# EAGLE design main_R1 (EAGLE 7.1.0)
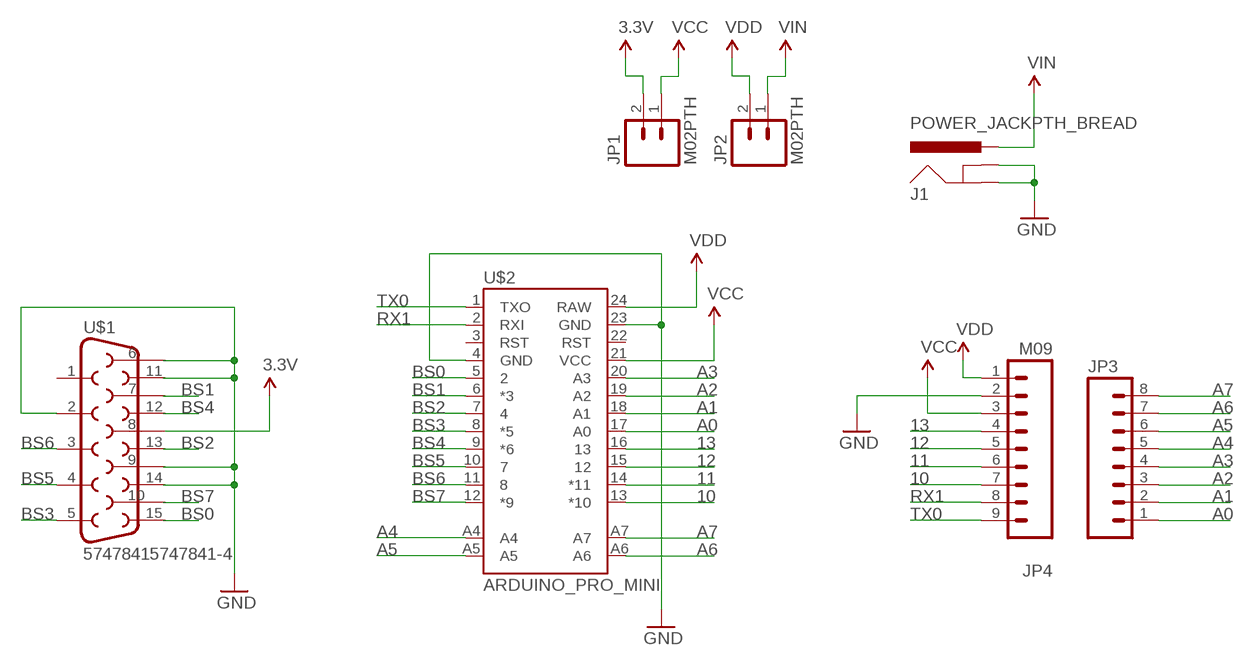
[diagram p0: schematic, sheet 1]

## Parts
J1  POWER_JACKPTH_BREAD  [POWER_JACK_PTH_BREAD]
JP1  M02PTH  [1X02]
JP2  M02PTH  [1X02]
JP3  M081X08  [1X08]
JP4  M09  [1X09]
U$1  57478415747841-4  [5747841]
U$2  ARDUINO_PRO_MINI  [ARDUINO_PRO_MINI]

## Nets
3.3V: JP1.2 U$1.8
10: JP4.7 U$2.13(*10)
11: JP4.6 U$2.14(*11)
12: JP4.5 U$2.15
13: JP4.4 U$2.16
A0: JP3.1 U$2.17(A0)
A1: JP3.2 U$2.18(A1)
A2: JP3.3 U$2.19(A2)
A3: JP3.4 U$2.20(A3)
A4: JP3.5 U$2.A4
A5: JP3.6 U$2.A5
A6: JP3.7 U$2.A6
A7: JP3.8 U$2.A7
BS0: U$1.15 U$2.5
BS1: U$1.7 U$2.6(*3)
BS2: U$1.13 U$2.7
BS3: U$1.5 U$2.8(*5)
BS4: U$1.12 U$2.9(*6)
BS5: U$1.4 U$2.10
BS6: U$1.3 U$2.11
BS7: U$1.10 U$2.12(*9)
GND: J1.GND J1.GNDBREAK JP4.2 U$1.2 U$1.6 U$1.9 U$1.11 U$1.14 U$2.4(GND) U$2.23(GND)
RX1: JP4.8 U$2.2(RXI)
TX0: JP4.9 U$2.1(TXO)
VCC: JP1.1 JP4.3 U$2.21(VCC)
VDD: JP2.2 JP4.1 U$2.24(RAW)
VIN: J1.PWR JP2.1
Unconnected: U$1.1 U$2.3(RST) U$2.22(RST)

## Library data of the parts
J1 = SparkFun-Connectors:POWER_JACK: Power Jack This is the standard 5.5mm barrel jack for power. The PTH is the most common, proven, reliable, footprint. The Slot footprint only works if the mill layer is transmitted to the PCB fab house so be warned. Mating wall wart : TOL-00298 (and others); PROD_ID: PRT-10811
JP1 JP2 = SparkFun-Connectors:M02: Standard 2-pin 0.1" header. Use with - straight break away headers ( PRT-00116) - right angle break away headers (PRT-00553) - swiss pins (PRT-00743) - machine pins (PRT-00117) - female headers (PRT-00115) Molex polarized connector foot print use with: PRT-08233 with associated crimp pins and housings. 2.54_SCREWTERM for use with PRT-10571. 3.5mm Screw Terminal footprints for PRT-08084 5mm Screw Terminal footprints for use with PRT-08433
JP3 = SparkFun-Connectors:M08: Header 8 Standard 8-pin 0.1" header. Use with straight break away headers (SKU : PRT-00116), right angle break away headers (PRT-00553), swiss pins (PRT-00743), machine pins (PRT-00117), and female headers (PRT-00115).
JP4 = SparkFun-Connectors:M09: Header 9 Standard 9-pin 0.1" header. Use with straight break away headers (SKU : PRT-00116), right angle break away headers (PRT-00553), swiss pins (PRT-00743), machine pins (PRT-00117), and female headers (PRT-00115).
U$1 = myLibrary:5747841
U$2 = SparkFun-Boards:ARDUINO_PRO_MINI

## Board
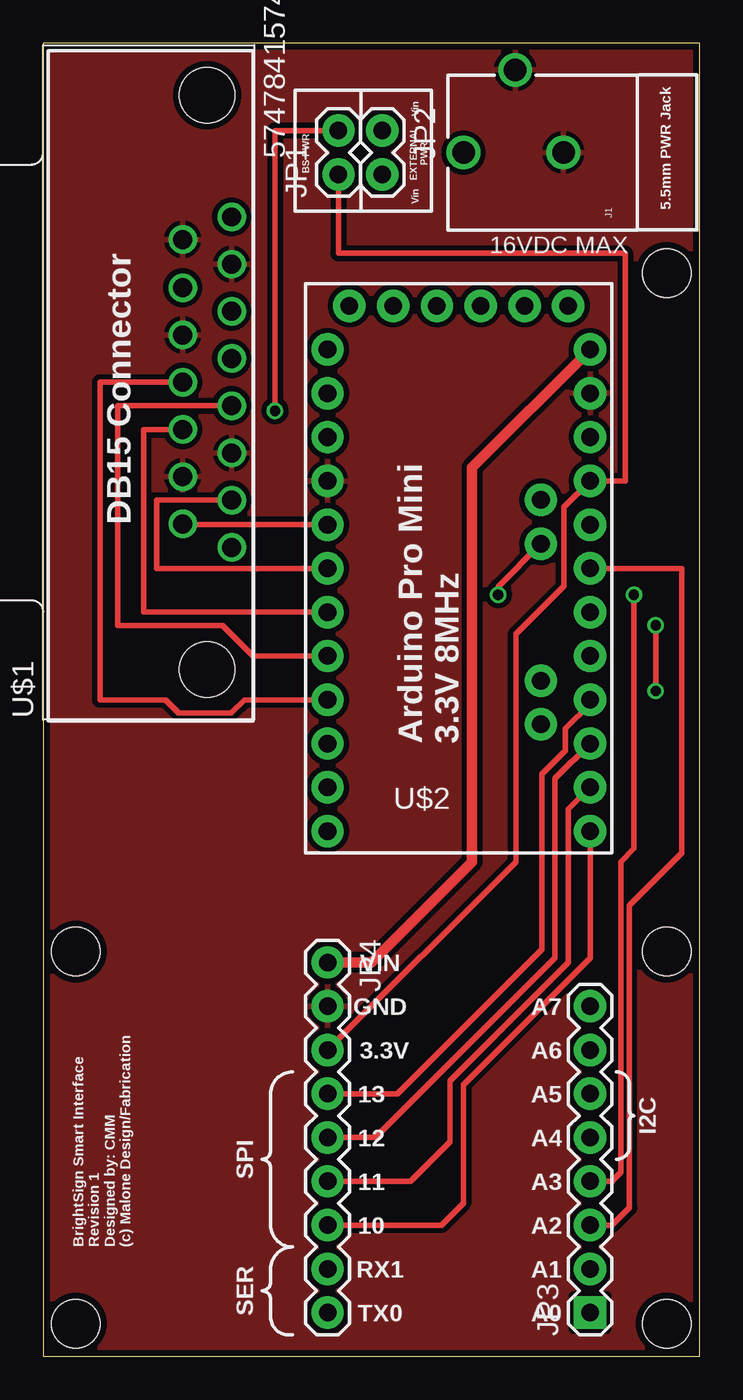
[diagram p1: board, top side]
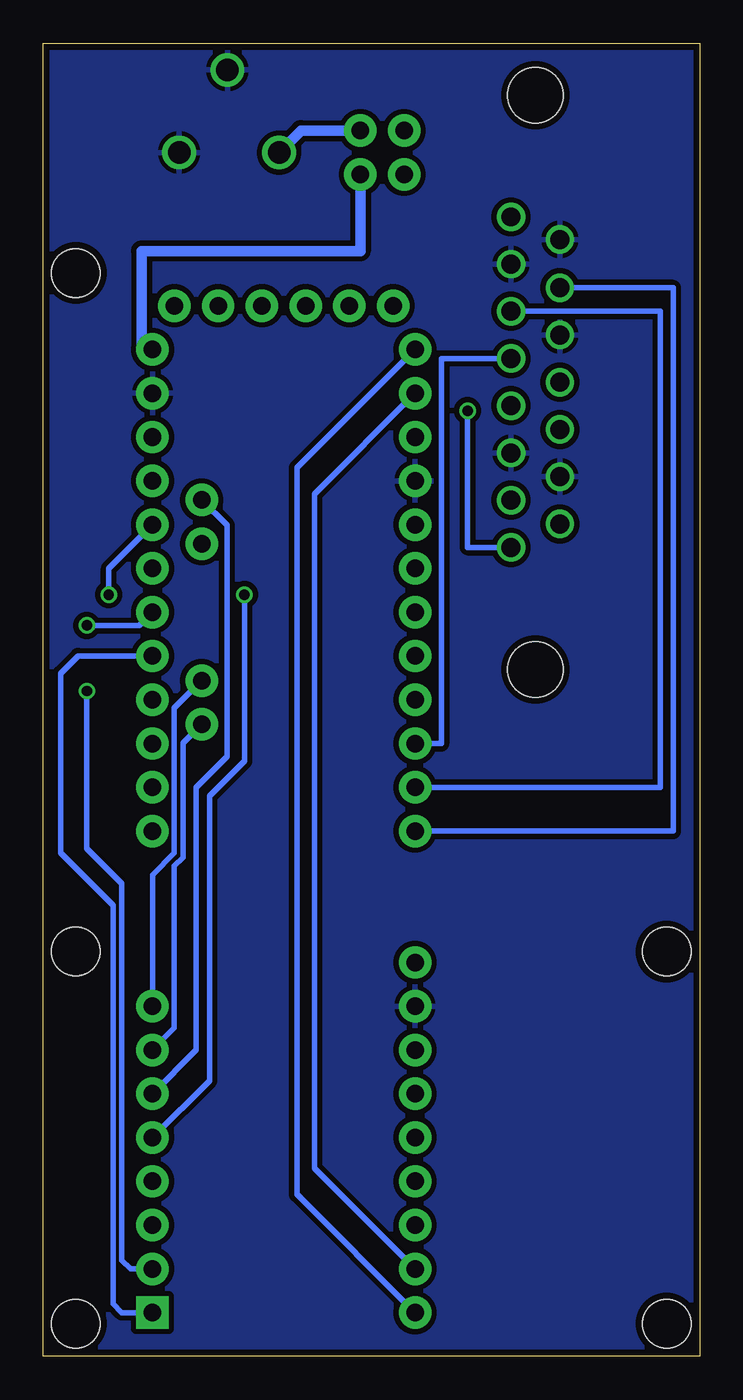
[diagram p2: board, bottom side, seen from below]

Size 38.1 x 76.2 mm. Coordinates in mm from the lower left corner, seen from the top.
Outline: 0,0 38.1,0 38.1,76.2 0,76.2 0,0
Copper layers (1*16): Top 0.0356mm / dielectric 1.5011mm / Bottom 0.0356mm
Design rules "LaenPCBOrder": minimum track width 6mil, minimum drill 13mil, track to track 6mil, track to pad 6mil, pad to pad 6mil, via to via 6mil, smd to smd 6mil, copper to edge 15mil, drill to drill 6mil, minimum pad ring 7mil, minimum via ring 7mil, stop-mask expansion 3mil, vias tented up to drill 0mil, thermal gap 10mil
Holes 2.8 mm at 1.91,1.91 36.2,1.91 36.2,62.87 1.91,23.5 36.2,23.5

### Footprints (pad centres in the part's own frame; a part is rotated, then mirrored left to right if it is on the bottom)
POWER_JACK_PTH_BREAD = drill 1.3: GND 0,7.9; GNDBREAK 4.8,10.7; PWR 0,13.7
1X02 = drill 1.016 pad 1.88: 1 0,0; 2 2.54,0
1X08 = drill 1.016 pad 1.88 square: 1 0,0 | drill 1.016 pad 1.88: 2 2.54,0; 3 5.08,0; 4 7.62,0; 5 10.16,0; 6 12.7,0; 7 15.24,0; 8 17.78,0
1X09 = drill 1.016 pad 1.88: 1 0,0; 2 2.54,0; 3 5.08,0; 4 7.62,0; 5 10.16,0; 6 12.7,0; 7 15.24,0; 8 17.78,0; 9 20.32,0
5747841 = drill 1.1: 1 9.6,-1.42; 2 6.86,-1.42; 3 4.12,-1.42; 4 1.38,-1.42; 5 -1.36,-1.42; 6 -4.1,-1.42; 7 -6.84,-1.42; 8 -9.58,-1.42; 9 8.29,1.42; 10 5.49,1.42; 11 2.75,1.42; 12 0.01,1.42; 13 -2.73,1.42; 14 -5.47,1.42; 15 -8.21,1.42 | hole 3.2: -16.66,0; 16.66,0
ARDUINO_PRO_MINI = drill 1.016 pad 1.88: 1 -7.62,12.7; 2 -7.62,10.16; 3 -7.62,7.62; 4 -7.62,5.08; 5 -7.62,2.54; 6 -7.62,0; 7 -7.62,-2.54; 8 -7.62,-5.08; 9 -7.62,-7.62; 10 -7.62,-10.16; 11 -7.62,-12.7; 12 -7.62,-15.24; 13 7.62,-15.24; 14 7.62,-12.7; 15 7.62,-10.16; 16 7.62,-7.62; 17 7.62,-5.08; 18 7.62,-2.54; 19 7.62,0; 20 7.62,2.54; 21 7.62,5.08; 22 7.62,7.62; 23 7.62,10.16; 24 7.62,12.7; A4 4.763,1.429; A5 4.763,3.969; A6 4.763,-9.049; A7 4.763,-6.509; BLK -6.35,15.24; GND -3.81,15.24; GRN 6.35,15.24; RXI 1.27,15.24; TXO 3.81,15.24; VCC -1.27,15.24

### Placement (x,y rotation side)
J1  38.1,69.85 90 top
JP1  17.14,68.58 90 top
JP2  19.68,71.12 270 top
JP3  31.75,2.54 90 top
JP4  16.51,22.86 270 top
U$1  9.53,56.52 90 top
U$2  24.13,45.72 0 top

### Tracks (layer width: path | path; a pad name or v marks a point on that pad's centre or on a via)
3.3V  (via drill 0.6)
  Top 0.305: JP1.2 13.46,71.12 v13.46,54.86
  Bottom 0.305: v13.46,54.86 13.46,46.94 U$1.8
10
  Top 0.305: U$2.13 31.75,23.11 24.38,15.75 24.38,8.89 23.11,7.62 JP4.7
11
  Top 0.305: U$2.14 30.48,31.75 30.48,22.86 23.62,16 23.62,12.45 21.34,10.16 JP4.6
12
  Top 0.305: U$2.15 29.72,33.53 29.72,23.11 19.3,12.7 JP4.5
13
  Top 0.305: JP4.4 20.57,15.24 28.96,23.62 28.96,33.78 30.33,35.15 30.33,36.42 31.75,37.85 U$2.16
A0
  Bottom 0.305: JP3.1 33.53,2.54 34.04,3.05 34.04,26.16 37.08,29.21 37.08,39.62 36.07,40.64 U$2.17
A1  (via drill 0.6)
  Top 0.305: v35.56,38.61 v35.56,42.42
  Bottom 0.305: JP3.2 33.02,5.08 33.53,5.59 33.53,27.43 35.56,29.46 v35.56,38.61 | v35.56,42.42 32.51,42.42 U$2.18
A2
  Top 0.305: JP3.3 33.02,7.62 34.04,8.64 34.04,26.16 37.08,29.21 37.08,45.72 U$2.19
A3  (via drill 0.6)
  Top 0.305: JP3.4 33.02,10.16 33.53,10.67 33.53,28.7 34.29,29.46 v34.29,44.2
  Bottom 0.305: v34.29,44.2 34.29,45.72 U$2.20
A4  (via drill 0.6)
  Top 0.305: v26.42,44.2 26.42,44.67 U$2.A4
  Bottom 0.305: JP3.5 28.45,16 28.45,32.51 26.42,34.54 v26.42,44.2
A5
  Bottom 0.305: JP3.6 29.21,17.78 29.21,33.02 27.43,34.8 27.43,48.23 U$2.A5
A6
  Bottom 0.305: U$2.A6 29.97,35.59 29.97,28.96 30.48,28.45 30.48,19.05 JP3.7
A7
  Bottom 0.305: JP3.8 31.75,27.94 30.48,29.21 30.48,37.62 U$2.A7
BS0
  Top 0.305: U$2.5 8.11,48.26 U$1.15
BS1
  Top 0.305: U$2.6 6.6,45.72 6.6,49.67 U$1.7
BS2
  Top 0.305: U$2.7 5.84,43.18 5.84,53.78 U$1.13
BS3
  Top 0.305: U$2.8 12.19,40.64 10.41,42.42 4.32,42.42 4.32,55.16 U$1.5
BS4
  Top 0.305: U$2.9 11.68,38.1 10.92,37.34 7.87,37.34 7.11,38.1 3.3,38.1 3.3,56.52 U$1.12
BS5
  Bottom 0.305: U$1.4 14.99,57.9 14.99,35.56 U$2.10
BS6
  Bottom 0.305: U$1.3 10.95,60.66 2.29,60.66 2.29,33.02 U$2.11
BS7
  Bottom 0.305: U$2.12 1.52,30.48 1.52,62.01 U$1.10
GND
  pour Bottom (isolate 0.305): 0,0 38.1,0 38.1,76.2 0,76.2
  pour Top (isolate 0.305): 0,0 38.1,0 38.1,76.2 0,76.2
RX1
  Bottom 0.305: JP4.8 22.35,10.92 22.35,50.04 U$2.2
TX0
  Bottom 0.305: JP4.9 23.37,9.4 23.37,51.56 U$2.1
VCC
  Top 0.305: JP4.3 27.43,28.7 27.43,41.91 30.23,44.7 30.23,49.28 U$2.21 33.78,50.8 33.78,64.01 17.14,64.01 JP1.1
VDD
  Top 0.61: U$2.24 24.89,51.56 24.89,28.7 19.05,22.86 JP4.1
  Bottom 0.61: JP2.2 19.68,64.14 32.38,64.14 32.38,58.42 U$2.24
VIN
  Bottom 0.61: J1.PWR 23.13,71.12 JP2.1

### Text on the board
_tsilk: Vin | BS PWR | EXTERNAL / PWR | 5.5mm PWR Jack | Vin | 16VDC MAX | DB15 Connector | Arduino Pro Mini / 3.3V 8MHz | VIN | GND | A7 | 3.3V | A6 | 13 | A5 | I2C | 12 | A4 | SPI | 11 | A3 | 10 | A2 | BrightSign Smart Interface / Revision 1 / Designed by: CMM / (c) Malone Design/Fabrication | RX1 | A1 | SER | TX0 | A0